# EAGLE design RPiZWAdapterBoard-Rev4 (EAGLE 9.5.1)
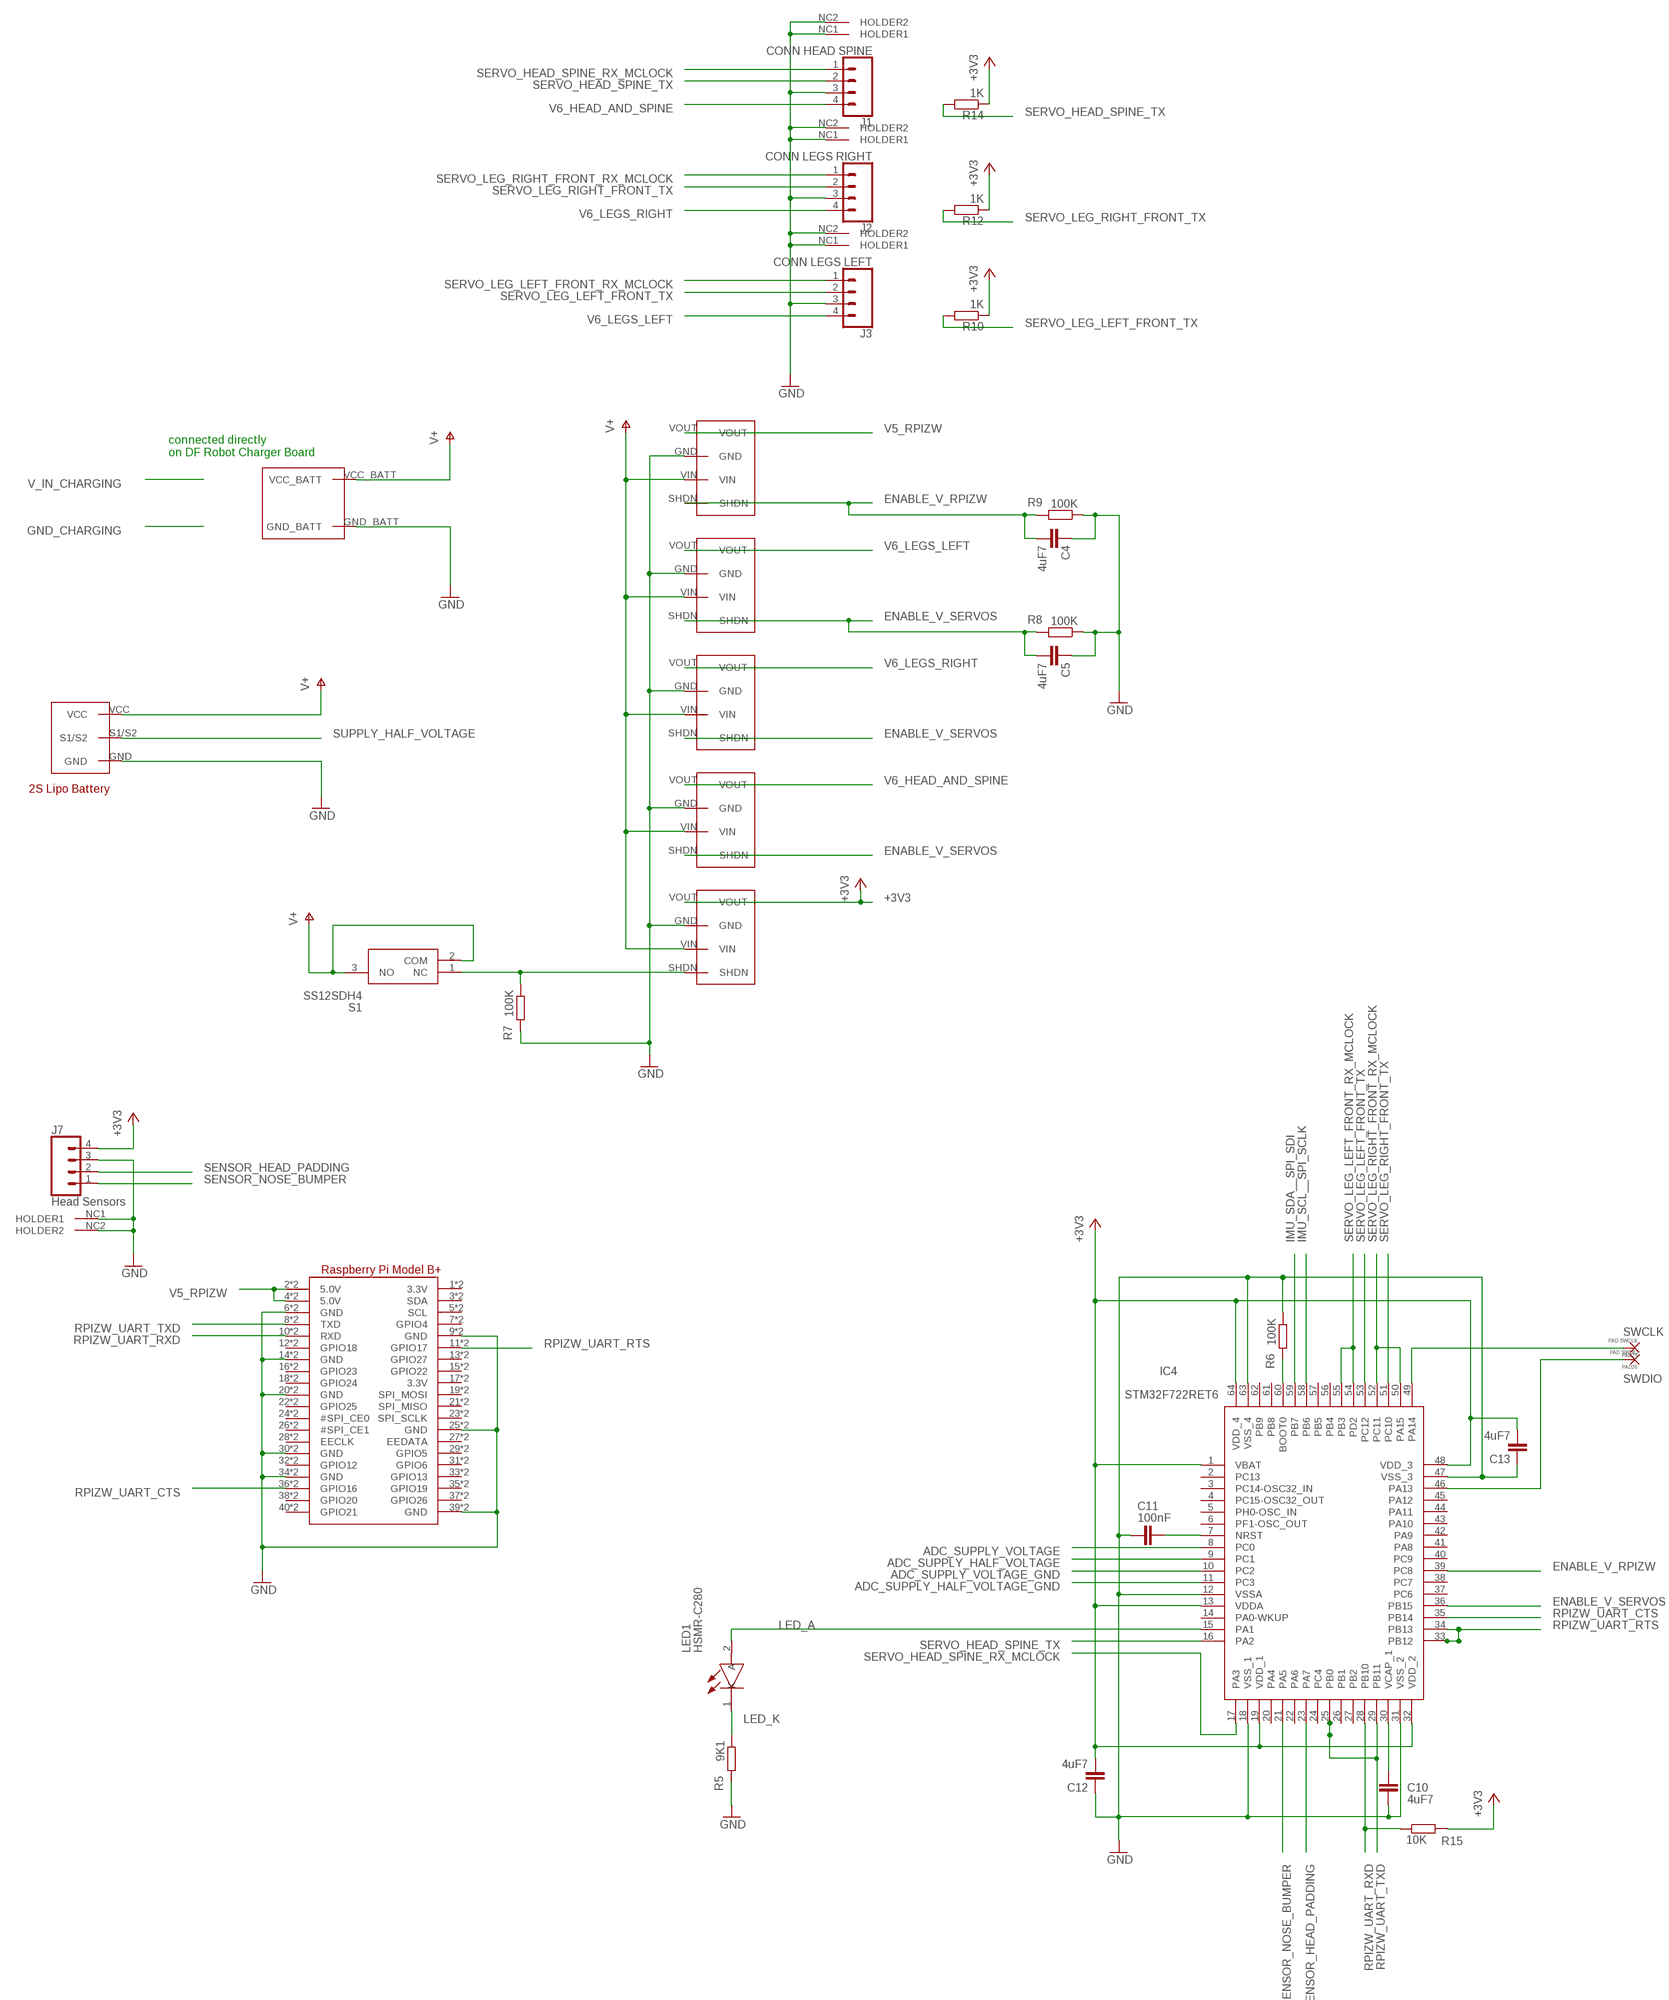
[diagram p0: schematic, sheet 1, part 1 of 2]
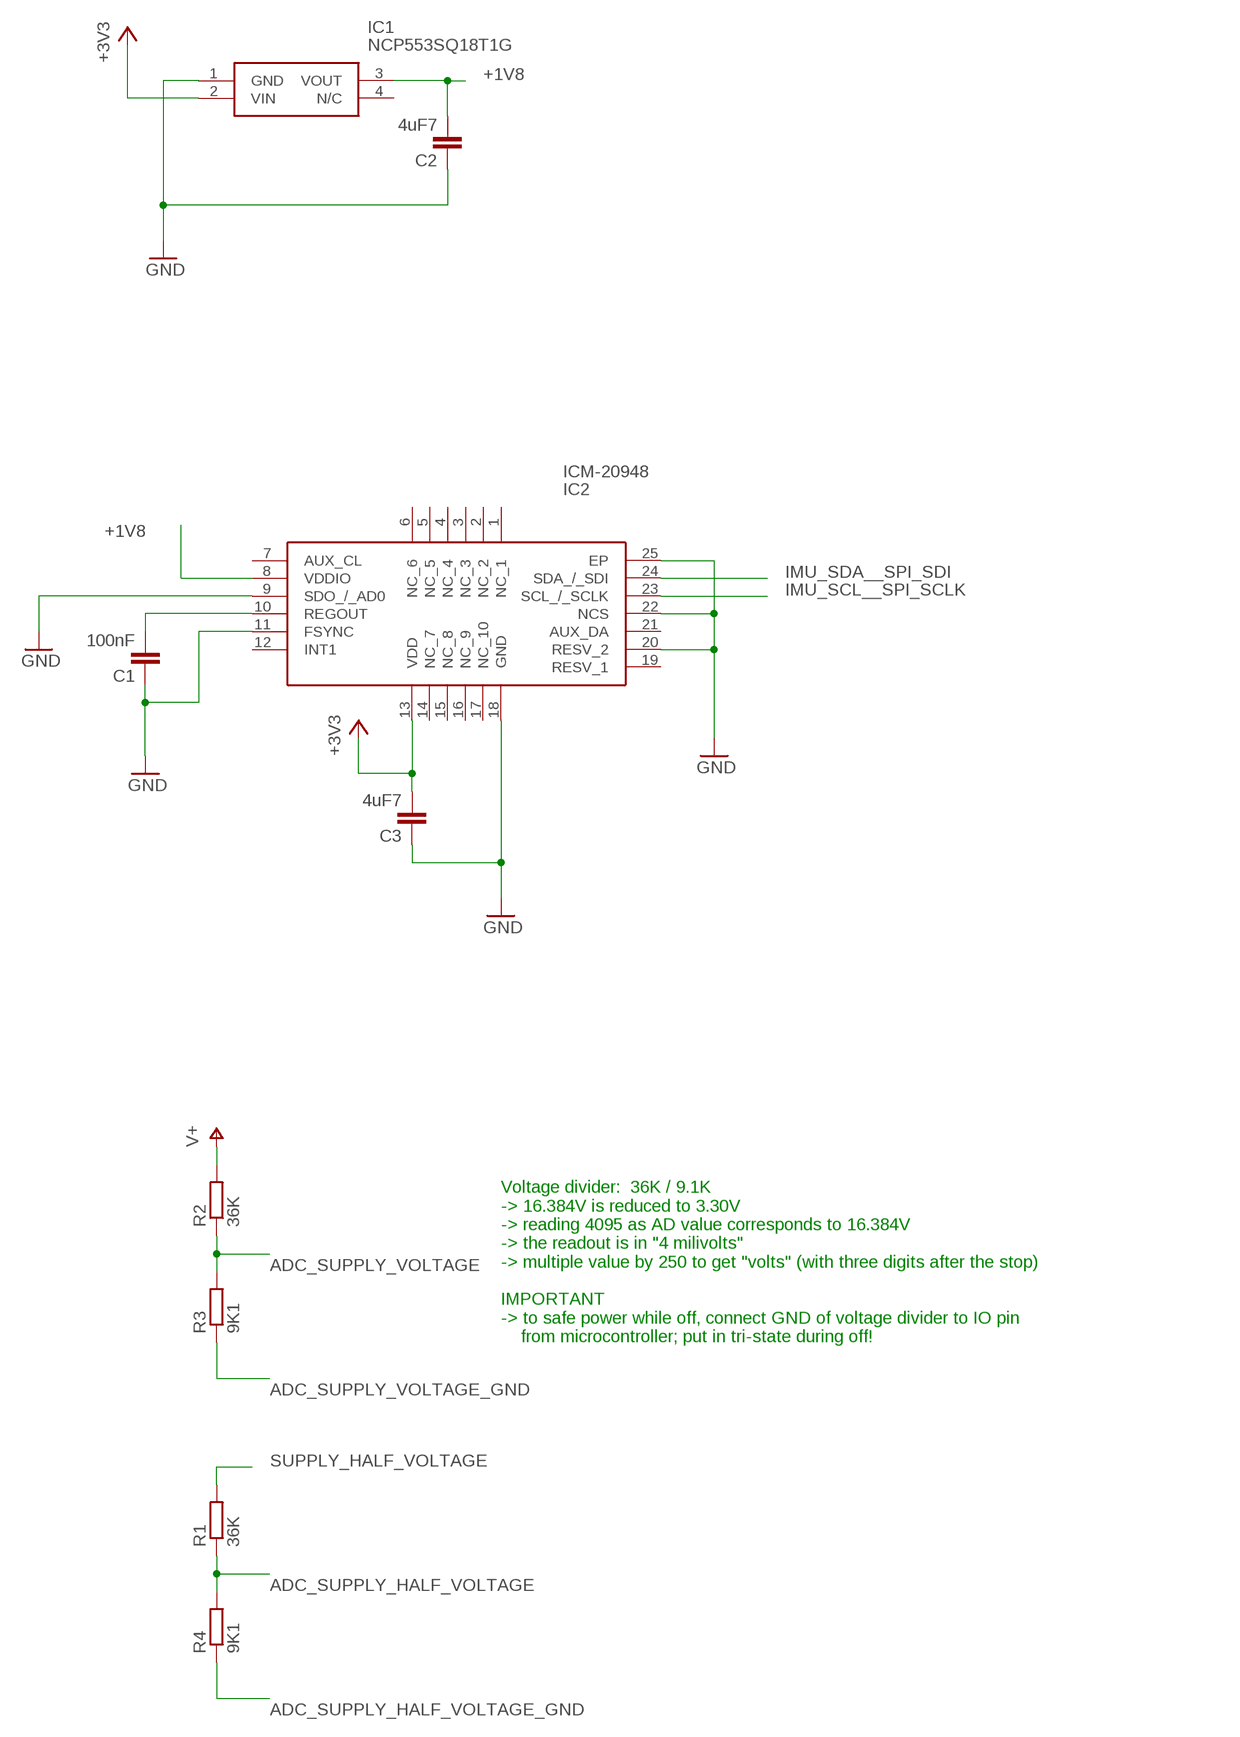
[diagram p1: schematic, sheet 1, part 2 of 2]

## Parts
C1  100nF  C-EUC0402  [C0402]
C2  4uF7  C-EUC0402  [C0402]
C3  4uF7  C-EUC0402  [C0402]
C4  4uF7  C-EUC0402  [C0402]
C5  4uF7  C-EUC0402  [C0402]
C10  4uF7  C-EUC0402  [C0402]
C11  100nF  C-EUC0402  [C0402]
C12  4uF7  C-EUC0402  [C0402]
C13  4uF7  C-EUC0402  [C0402]
IC1  NCP553SQ18T1G  [NCP563SQ18T1G]
IC2  ICM-20948  [QFN40P300X300X105-25N]
IC4  STM32F722RET6  [QFP50P1200X1200X160-64N]
J1  CONN HEAD SPINE  CONN_04SMD2  [JST04_SH_1MM]
J2  CONN LEGS RIGHT  CONN_04SMD2  [JST04_SH_1MM]
J3  CONN LEGS LEFT  CONN_04SMD2  [JST04_SH_1MM]
J7  Head Sensors  CONN_04SMD2  [JST04_SH_1MM]
LED1  HSMR-C280  [LEDC1005X50N]
PAD25  PAD SWCLK  SMD-PAD12X08  [SMD12X08]
PAD26  PAD SWDIO  SMD-PAD12X08  [SMD12X08]
R1  36K  R-EU_R0402  [R0402]
R2  36K  R-EU_R0402  [R0402]
R3  9K1  R-EU_R0402  [R0402]
R4  9K1  R-EU_R0402  [R0402]
R5  9K1  R-EU_R0402  [R0402]
R6  100K  R-EU_R0402  [R0402]
R7  100K  R-EU_R0402  [R0402]
R8  100K  R-EU_R0402  [R0402]
R9  100K  R-EU_R0402  [R0402]
R10  1K  R-EU_R0402  [R0402]
R12  1K  R-EU_R0402  [R0402]
R14  1K  R-EU_R0402  [R0402]
R15  10K  R-EU_R0402  [R0402]
RPI1  MICROBUILDER_RASPBERRYPI_BPLUSWIDE  [MICROBUILDER_PI_BONNET_THMSMT_WIDE]
S1  SS12SDH4  [SS12SDH4]
U$1  POLOLU_REGULATOR  [POLOLU_REGULATOR]
U$3  POLOLU_REGULATOR  [POLOLU_REGULATOR]
U$4  POLOLU_REGULATOR  [POLOLU_REGULATOR]
U$5  POLOLU_REGULATOR  [POLOLU_REGULATOR]
U$6  POLOLU_REGULATOR  [POLOLU_REGULATOR]
U$7  JST-S3B-XH-A_BATTCON  [JST-S3B-XH-A]
U$8  DFROBOT_CHARGER_CUTOUTNARROW  [DFROBOT_CHARGER_CUTOUT_NARROW]

## Nets
+1V8 [Power]: C2.2 IC1.3(VOUT) IC2.8(VDDIO)
+3V3 [Power]: C3.2 C12.2 C13.2 IC1.2(VIN) IC2.13(VDD) IC4.1(VBAT) IC4.13(VDDA) IC4.19(VDD_1) IC4.32(VDD_2) IC4.48(VDD_3) IC4.64(VDD_4) J7.4 R10.1 R12.1 R14.1 R15.2 U$6.VOUT
ADC_SUPPLY_HALF_VOLTAGE: IC4.9(PC1) R1.1 R4.2
ADC_SUPPLY_HALF_VOLTAGE_GND: IC4.11(PC3) R4.1
ADC_SUPPLY_VOLTAGE: IC4.8(PC0) R2.1 R3.2
ADC_SUPPLY_VOLTAGE_GND: IC4.10(PC2) R3.1
ENABLE_V_RPIZW: C4.2 IC4.39(PC8) R9.2 U$1.SHDN
ENABLE_V_SERVOS: C5.2 IC4.36(PB15) R8.2 U$3.SHDN U$4.SHDN U$5.SHDN
GND [Power]: C1.1 C2.1 C3.1 C4.1 C5.1 C10.1 C11.2 C12.1 C13.1 IC1.1(GND) IC2.9(SDO_/_AD0) IC2.11(FSYNC) IC2.18(GND) IC2.20(RESV_2) IC2.22(NCS) IC2.25(EP) IC4.12(VSSA) IC4.18(VSS_1) IC4.31(VSS_2) IC4.47(VSS_3) IC4.63(VSS_4) J1.3 J1.NC1(HOLDER1) J1.NC2(HOLDER2) J2.3 J2.NC1(HOLDER1) J2.NC2(HOLDER2) J3.3 J3.NC1(HOLDER1) J3.NC2(HOLDER2) J7.3 J7.NC1(HOLDER1) J7.NC2(HOLDER2) R5.2 R6.1 R7.2 R8.1 R9.1 RPI1.6(GND) RPI1.9(GND) RPI1.14(GND) RPI1.20(GND) RPI1.25(GND) RPI1.30(GND) RPI1.34(GND) RPI1.39(GND) RPI1.S6(GND) RPI1.S9(GND) RPI1.S14(GND) RPI1.S20(GND) RPI1.S25(GND) RPI1.S30(GND) RPI1.S34(GND) RPI1.S39(GND) U$1.GND U$3.GND U$4.GND U$5.GND U$6.GND U$7.GND U$8.GND_BATT
IMU_SCL__SPI_SCLK: IC2.23(SCL_/_SCLK) IC4.58(PB6)
IMU_SDA__SPI_SDI: IC2.24(SDA_/_SDI) IC4.59(PB7)
LED_A: IC4.15(PA1) LED1.2(A)
LED_K: LED1.1(K) R5.1
N$1: R7.1 S1.1(NC) U$6.SHDN
N$2: C1.2 IC2.10(REGOUT)
N$6: IC4.60(BOOT0) R6.2
N$7: C11.1 IC4.7(NRST)
N$8: C10.2 IC4.30(VCAP_1)
RPIZW_UART_CTS: IC4.35(PB14) RPI1.36(GPIO16) RPI1.S36(GPIO16)
RPIZW_UART_RTS: IC4.33(PB12) IC4.34(PB13) RPI1.11(GPIO17) RPI1.S11(GPIO17)
RPIZW_UART_RXD: IC4.28(PB10) R15.1 RPI1.10(RXD) RPI1.S10(RXD)
RPIZW_UART_TXD: IC4.25(PB0) IC4.29(PB11) RPI1.8(TXD) RPI1.S8(TXD)
SENSOR_HEAD_PADDING: IC4.23(PA7) J7.2
SENSOR_NOSE_BUMPER: IC4.21(PA5) J7.1
SERVO_HEAD_SPINE_RX_MCLOCK: IC4.17(PA3) J1.1
SERVO_HEAD_SPINE_TX: IC4.16(PA2) J1.2 R14.2
SERVO_LEG_LEFT_FRONT_RX_MCLOCK: IC4.54(PD2) IC4.55(PB3) J3.1
SERVO_LEG_LEFT_FRONT_TX: IC4.53(PC12) J3.2 R10.2
SERVO_LEG_RIGHT_FRONT_RX_MCLOCK: IC4.50(PA15) IC4.52(PC11) J2.1
SERVO_LEG_RIGHT_FRONT_TX: IC4.51(PC10) J2.2 R12.2
SUPPLY_HALF_VOLTAGE: R1.2 U$7.S1/S2
SWCLK: IC4.49(PA14) PAD25.1(P)
SWDIO: IC4.46(PA13) PAD26.1(P)
V5_RPIZW [Power]: RPI1.2(5.0V) RPI1.4(5.0V) RPI1.S2(5.0V) RPI1.S4(5.0V) U$1.VOUT
V6_HEAD_AND_SPINE [Power]: J1.4 U$5.VOUT
V6_LEGS_LEFT [Power]: J3.4 U$3.VOUT
V6_LEGS_RIGHT [Power]: J2.4 U$4.VOUT
V+ [Power]: R2.2 S1.2(COM) S1.3(NO) U$1.VIN U$3.VIN U$4.VIN U$5.VIN U$6.VIN U$7.VCC U$8.VCC_BATT
Unconnected: IC1.4(N/C) IC2.1(NC_1) IC2.2(NC_2) IC2.3(NC_3) IC2.4(NC_4) IC2.5(NC_5) IC2.6(NC_6) IC2.7(AUX_CL) IC2.12(INT1) IC2.14(NC_7) IC2.15(NC_8) IC2.16(NC_9) IC2.17(NC_10) IC2.19(RESV_1) IC2.21(AUX_DA) IC4.2(PC13) IC4.3(PC14-OSC32_IN) IC4.4(PC15-OSC32_OUT) IC4.5(PH0-OSC_IN) IC4.6(PF1-OSC_OUT) IC4.14(PA0-WKUP) IC4.20(PA4) IC4.22(PA6) IC4.24(PC4) IC4.26(PB1) IC4.27(PB2) IC4.37(PC6) IC4.38(PC7) IC4.40(PC9) IC4.41(PA8) IC4.42(PA9) IC4.43(PA10) IC4.44(PA11) IC4.45(PA12) IC4.56(PB4) IC4.57(PB5) IC4.61(PB8) IC4.62(PB9) RPI1.1(3.3V) RPI1.3(SDA) RPI1.5(SCL) RPI1.7(GPIO4) RPI1.12(GPIO18) RPI1.13(GPIO27) RPI1.15(GPIO22) RPI1.16(GPIO23) RPI1.17(3.3V) RPI1.18(GPIO24) RPI1.19(SPI_MOSI) RPI1.21(SPI_MISO) RPI1.22(GPIO25) RPI1.23(SPI_SCLK) RPI1.24(#SPI_CE0) RPI1.26(#SPI_CE1) RPI1.27(EEDATA) RPI1.28(EECLK) RPI1.29(GPIO5) RPI1.31(GPIO6) RPI1.32(GPIO12) RPI1.33(GPIO13) RPI1.35(GPIO19) RPI1.37(GPIO26) RPI1.38(GPIO20) RPI1.40(GPIO21) RPI1.S1(3.3V) RPI1.S3(SDA) RPI1.S5(SCL) RPI1.S7(GPIO4) RPI1.S12(GPIO18) RPI1.S13(GPIO27) RPI1.S15(GPIO22) RPI1.S16(GPIO23) RPI1.S17(3.3V) RPI1.S18(GPIO24) RPI1.S19(SPI_MOSI) RPI1.S21(SPI_MISO) RPI1.S22(GPIO25) RPI1.S23(SPI_SCLK) RPI1.S24(#SPI_CE0) RPI1.S26(#SPI_CE1) RPI1.S27(EEDATA) RPI1.S28(EECLK) RPI1.S29(GPIO5) RPI1.S31(GPIO6) RPI1.S32(GPIO12) RPI1.S33(GPIO13) RPI1.S35(GPIO19) RPI1.S37(GPIO26) RPI1.S38(GPIO20) RPI1.S40(GPIO21)

## Notes on the sheet
- connected directly
  on DF Robot Charger Board
- Voltage divider:  36K / 9.1K 
  -> 16.384V is reduced to 3.30V
  -> reading 4095 as AD value corresponds to 16.384V
  -> the readout is in "4 milivolts"
  -> multiple value by 250 to get "volts" (with three digits after the stop)
  
  IMPORTANT
  -> to safe power while off, connect GND of voltage divider to IO pin
      from microcontroller; put in tri-state during off!

## Library data of the parts
C1-C5 C10-C13 = rcl:C-EU: CAPACITOR, European symbol; SPICEPREFIX: C
IC1 = HBPMouse:NCP553SQ18T1G: LDO Voltage Regulators LDO LINEAR REGULATOR Source: Datasheet <https://componentsearchengine.com/Datasheets/1/NCV553SQ30T1G.pdf>; DESCRIPTION: LDO Voltage Regulators LDO LINEAR REGULATOR; HEIGHT: mm; MANUFACTURER_NAME: ON Semiconductor; MANUFACTURER_PART_NUMBER: NCV553SQ30T1G; MOUSER_PART_NUMBER: 863-NCV553SQ30T1G; MOUSER_PRICE-STOCK: https://www.mouser.com/Search/Refine.aspx?Keyword=863-NCV553SQ30T1G
IC2 = HBPMouse:ICM-20948: IMUs - Inertial Measurement Units World's Lowest Power 9-Axis MEMS MotionTracking Device Source: Datasheet <https://www.mouser.co.uk/datasheet/2/400/DS-000189-ICM-20948-v1.3-1385562.pdf>; DESCRIPTION: IMUs - Inertial Measurement Units World's Lowest Power 9-Axis MEMS MotionTracking Device; HEIGHT: 1.05mm; MANUFACTURER_NAME: TDK; MANUFACTURER_PART_NUMBER: ICM-20948; MOUSER_PART_NUMBER: 410-ICM-20948
IC4 = HBPMouse:STM32F722RET6: ARM Microcontrollers - MCU High-performance and DSP with FPU, ARM(r) Cortex(r)-M7 MCU with 512 Kbytes Flash, 216 MHz CPU, Art Accelerator, L1 cache, SDRAM Source: Datasheet <https://componentsearchengine.com/Datasheets/1/STM32F722RET6.pdf>; DESCRIPTION: ARM Microcontrollers - MCU High-performance and DSP with FPU, ARM(r) Cortex(r)-M7 MCU with 512 Kbytes Flash, 216 MHz CPU, Art Accelerator, L1 cache, SDRAM; HEIGHT: 1.6mm; MANUFACTURER_NAME: STMicroelectronics; MANUFACTURER_PART_NUMBER: STM32F722RET6; MOUSER_PART_NUMBER: 511-STM32F722RET6; MOUSER_PRICE-STOCK: https://www.mouser.com/Search/Refine.aspx?Keyword=511-STM32F722RET6
J1-J3 J7 = HBPMouse:CONN_04: Multi connection point. Often used as Generic Header-pin footprint for 0.1 inch spaced/style header connections On any of the 0.1 inch spaced packages, you can populate with these: Break Away Headers - Straight <https://www.sparkfun.com/products/116> (PRT-00116) Break Away Male Headers - Right Angle <https://www.sparkfun.com/products/553> (PRT-00553) Female Headers <https://www.sparkfun.com/products/115> (PRT-00115) Break Away Headers - Machine Pin <https://www.sparkfun.com/products/117> (PRT-00117) Break Away Female Headers - Swiss Machine Pin <https://www.sparkfun.com/products/743> (PRT-00743) For SCREWTERMINALS and SPRING TERMINALS visit here: Screw Terimnals on SparkFun.com <https://www.sparkfun.com/search/results?term=Screw+Terminals> (5mm/3.5mm/2.54mm spacing) This device is also useful as a general connection point to wire up your design to another part of your project. Our various solder wires solder well into these plated through hole pads. Hook-Up Wire - Assortment (Stranded, 22 AWG) <https://www.sparkfun.com/products/11375> (PRT-11375) Hook-Up Wire - Assortment (Solid Core, 22 AWG) <https://www.sparkfun.com/products/11367> (PRT-11367) View the entire wire category on our website here <https://www.sparkfun.com/categories/141> Special notes: Molex polarized connector foot print use with SKU : PRT-08231 with associated crimp pins and housings. 1MM SMD Version SKU: PRT-10208; PROD_ID: CONN-10310; SF_ID: PRT-10208
LED1 = HBPMouse:HSMR-C280: BROADCOM LIMITED - HSMR-C280 - LED, BLUE, 80MCD, 465NM, 0402 Source: Datasheet <https://media.digikey.com/pdf/Data Sheets/Avago PDFs/HSMR-C280.pdf>; DESCRIPTION: BROADCOM LIMITED - HSMR-C280 - LED, BLUE, 80MCD, 465NM, 0402; HEIGHT: 0.5mm; MANUFACTURER_NAME: Avago Technologies; MANUFACTURER_PART_NUMBER: HSMR-C280; MOUSER_PART_NUMBER: 630-HSMR-C280; MOUSER_PRICE-STOCK: https://www.mouser.com/Search/Refine.aspx?Keyword=630-HSMR-C280
PAD25 PAD26 = HBPMouse:SMD-PAD: SMD PAD
R1-R10 R12 R14 R15 = rcl:R-EU_: RESISTOR, European symbol; SPICEPREFIX: R
RPI1 = HBPMouse:MICROBUILDER_RASPBERRYPI_BPLUS
S1 = HBPMouse:SS12SDH4: PCB Slide Switch SPDT On-None-On 100 mA Side Source: Datasheet <https://componentsearchengine.com/Datasheets/1/SS12SDH4.pdf>; DESCRIPTION: PCB Slide Switch SPDT On-None-On 100 mA Side; HEIGHT: 4.5mm; MANUFACTURER_NAME: NKK Switches; MANUFACTURER_PART_NUMBER: SS12SDH4; MOUSER_PART_NUMBER: 633-SS12SDH4; MOUSER_PRICE-STOCK: https://www.mouser.com/Search/Refine.aspx?Keyword=633-SS12SDH4
U$1 U$3-U$6 = HBPMouse:POLOLU_REGULATOR
U$7 = HBPMouse:JST-S3B-XH-A_BATTCON: JST-XH Connector for 2S LIPO Battery
U$8 = HBPMouse:DFROBOT_CHARGER_CUTOUT

## Net classes
1 Power: width 0.3 mm

## Board
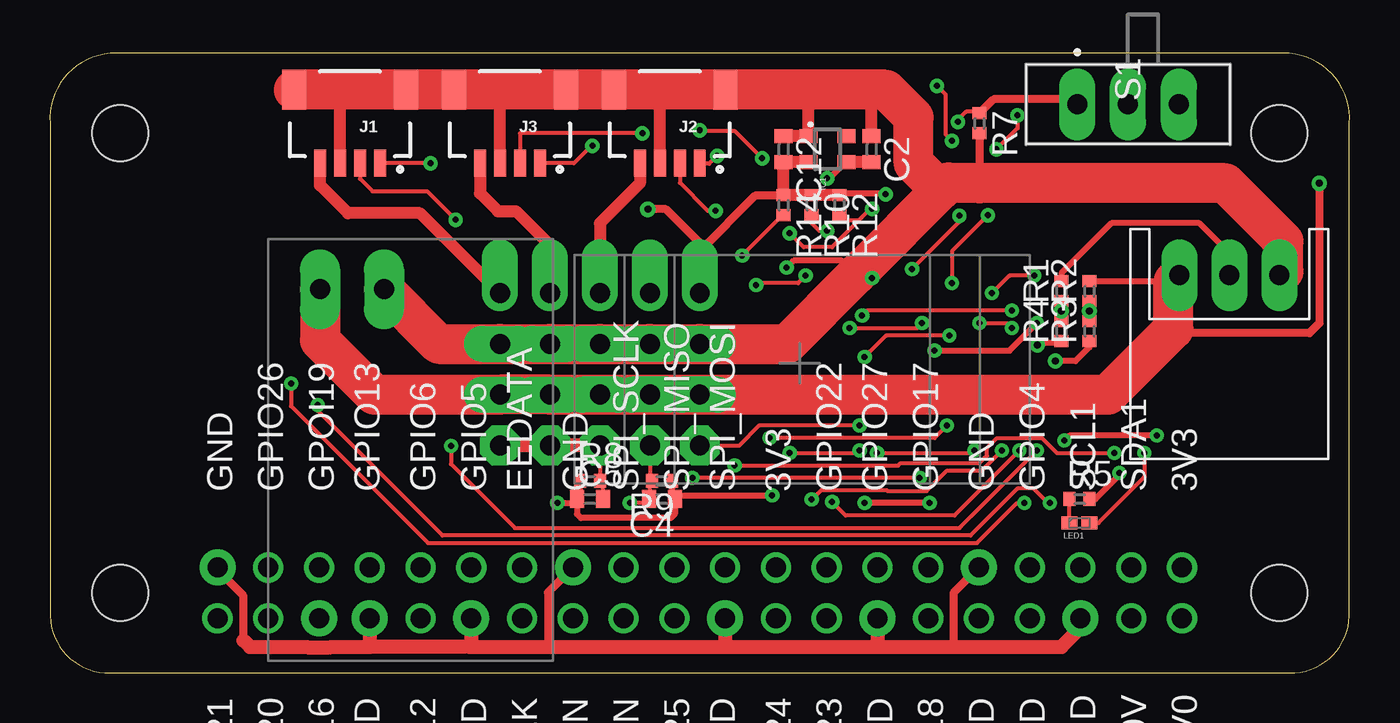
[diagram p2: board, top side]
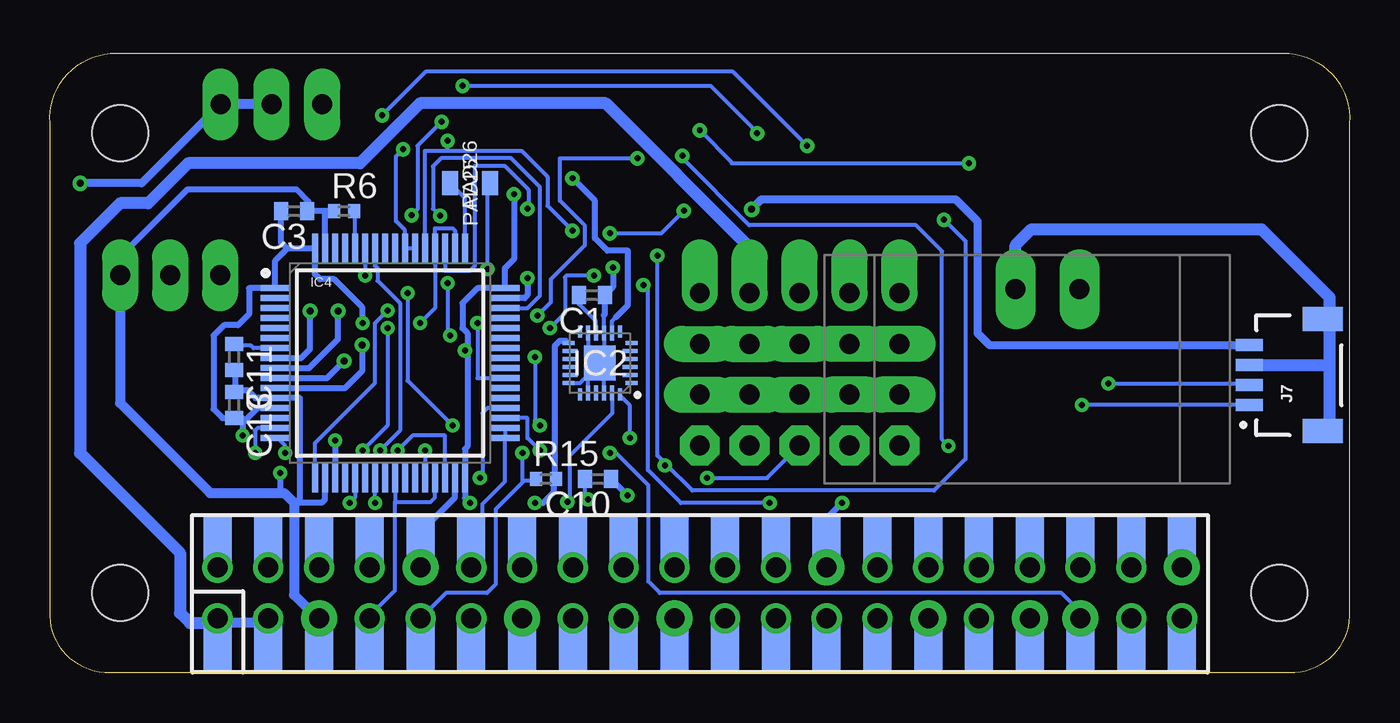
[diagram p3: board, bottom side, seen from below]

Size 65.02 x 31 mm. Coordinates in mm from the lower left corner, seen from the top.
Copper layers (1*16): Top 0.035mm / dielectric 0.8mm / Bottom 0.035mm
Design rules "default *": minimum track width 0.2mm, minimum drill 0.3mm, track to track 0.15mm, track to pad 0.17mm, pad to pad 0.17mm, via to via 0.15mm, smd to smd 0mil, copper to edge 0.2mm, drill to drill 0.3mm, minimum pad ring 10mil, minimum via ring 8mil, stop-mask expansion 2mil, vias tented up to drill 0mil, thermal gap 10mil
tRestrict: area 27.5,-2.5 to 31.2,0.7; area 63.9,20.4 to 67.6,23.6; area 25.7,30.3 to 29.4,33.5; area 50.9,30.4 to 54.6,33.6; area 53.2,30.4 to 56.9,33.6; area 23.6,18.3 to 23.8,21.5; area 26.1,18.3 to 26.3,21.5; area 28.6,18.3 to 28.8,21.5; area 31.1,18.3 to 31.3,21.5; area 20.6,17.6 to 34.2,17.9; area 20.6,15 to 34.2,15.3; area 20.6,12.5 to 34.2,12.8
bRestrict: area 63.9,20.1 to 67.6,23.3; area 26,30.3 to 29.7,33.5; area 50.7,30.4 to 54.4,33.6; area 23.7,18.3 to 23.9,21.5; area 26.2,18.3 to 26.4,21.5; area 28.7,18.3 to 28.9,21.5; area 31.2,18.3 to 31.4,21.5; area 20.6,14.9 to 34.2,15.5; area 20.6,17.4 to 34.2,18; area 20.6,12.4 to 34.2,13
vRestrict: area 7.2,3.8 to 57.7,4.2; area 12,2.3 to 12.2,5.5; area 9.5,2.3 to 9.7,5.5; area 14.6,2.3 to 14.8,5.5; area 17.1,2.3 to 17.3,5.5; area 19.6,2.3 to 19.8,5.5; area 22.2,2.3 to 22.4,5.5; area 24.7,2.3 to 24.9,5.5; area 27.3,2.3 to 27.5,5.5; area 29.8,2.3 to 30,5.5; area 32.4,2.3 to 32.6,5.5; area 35,2.3 to 35.2,5.5; area 37.4,2.3 to 37.6,5.5; area 40,2.3 to 40.2,5.5; area 42.6,2.3 to 42.8,5.5; area 45.1,2.3 to 45.3,5.5; area 47.7,2.3 to 47.9,5.5; area 50.2,2.3 to 50.4,5.5; area 52.7,2.3 to 52.9,5.5; area 55.2,2.4 to 55.4,5.6; area 57.8,2.4 to 58,5.6; area 9.5,5.1 to 9.7,8.3; area 12,5.1 to 12.2,8.3; area 14.6,5.1 to 14.8,8.3; area 17.1,5.1 to 17.3,8.3; area 19.6,5.1 to 19.8,8.3; area 22.2,5.1 to 22.4,8.3; area 24.7,5.1 to 24.9,8.3; area 27.3,5.1 to 27.5,8.3; area 29.8,5.1 to 30,8.3; area 32.4,5.1 to 32.6,8.3; area 35,5.1 to 35.2,8.3; area 37.4,5.1 to 37.6,8.3; area 40,5.1 to 40.2,8.3; area 42.6,5.1 to 42.8,8.3; area 45.1,5.1 to 45.3,8.3; area 47.7,5.1 to 47.9,8.3; area 50.2,5.1 to 50.4,8.3; area 52.7,5.1 to 52.9,8.3; area 55.2,5.1 to 55.4,8.3; area 57.8,5.1 to 58,8.3

### Footprints (pad centres in the part's own frame; a part is rotated, then mirrored left to right if it is on the bottom)
C0402 = smd 0.7 x 0.9: 1 -0.65,0; 2 0.65,0
NCP563SQ18T1G = smd 0.7 x 0.9: 1 -0.65,-0.95; 2 0.65,-0.95; 3 0.65,0.95; 4 -0.65,0.95
QFN40P300X300X105-25N = smd 0.6 x 0.2: 1 -1.575,1; 6 -1.575,-1; 13 1.575,-1; 18 1.575,1 | smd 0.75 x 0.2: 2 -1.5,0.6; 3 -1.5,0.2; 4 -1.5,-0.2; 5 -1.5,-0.6; 14 1.5,-0.6; 15 1.5,-0.2; 16 1.5,0.2; 17 1.5,0.6 | smd 0.2 x 0.6: 7 -1,-1.575; 12 1,-1.575; 19 1,1.575; 24 -1,1.575 | smd 0.2 x 0.75: 8 -0.6,-1.5; 9 -0.2,-1.5; 10 0.2,-1.5; 11 0.6,-1.5; 20 0.6,1.5; 21 0.2,1.5; 22 -0.2,1.5; 23 -0.6,1.5 | smd 1.59 x 1.75: 25 0,0
QFP50P1200X1200X160-64N = smd 1.475 x 0.3: 1 -5.738,3.75; 2 -5.738,3.25; 3 -5.738,2.75; 4 -5.738,2.25; 5 -5.738,1.75; 6 -5.738,1.25; 7 -5.738,0.75; 8 -5.738,0.25; 9 -5.738,-0.25; 10 -5.738,-0.75; 11 -5.738,-1.25; 12 -5.738,-1.75; 13 -5.738,-2.25; 14 -5.738,-2.75; 15 -5.738,-3.25; 16 -5.738,-3.75; 33 5.738,-3.75; 34 5.738,-3.25; 35 5.738,-2.75; 36 5.738,-2.25; 37 5.738,-1.75; 38 5.738,-1.25; 39 5.738,-0.75; 40 5.738,-0.25; 41 5.738,0.25; 42 5.738,0.75; 43 5.738,1.25; 44 5.738,1.75; 45 5.738,2.25; 46 5.738,2.75; 47 5.738,3.25; 48 5.738,3.75 | smd 0.3 x 1.475: 17 -3.75,-5.738; 18 -3.25,-5.738; 19 -2.75,-5.738; 20 -2.25,-5.738; 21 -1.75,-5.738; 22 -1.25,-5.738; 23 -0.75,-5.738; 24 -0.25,-5.738; 25 0.25,-5.738; 26 0.75,-5.738; 27 1.25,-5.738; 28 1.75,-5.738; 29 2.25,-5.738; 30 2.75,-5.738; 31 3.25,-5.738; 32 3.75,-5.738; 49 3.75,5.738; 50 3.25,5.738; 51 2.75,5.738; 52 2.25,5.738; 53 1.75,5.738; 54 1.25,5.738; 55 0.75,5.738; 56 0.25,5.738; 57 -0.25,5.738; 58 -0.75,5.738; 59 -1.25,5.738; 60 -1.75,5.738; 61 -2.25,5.738; 62 -2.75,5.738; 63 -3.25,5.738; 64 -3.75,5.738
JST04_SH_1MM = smd 0.6 x 1.35: 1 -1.5,0; 2 -0.5,0; 3 0.5,0; 4 1.5,0 | smd 1.2 x 2: NC1 2.8,-3.675; NC2 -2.8,-3.675
LEDC1005X50N = smd 0.8 x 0.65: 1 -0.5,0; 2 0.5,0
SMD12X08 = smd 0.8 x 1.2: 1 0,0
R0402 = smd 0.6 x 0.7: 1 -0.5,0; 2 0.5,0
MICROBUILDER_PI_BONNET_THMSMT_WIDE = drill 1 pad 1.4: 1 8.37,25.23; 2 8.37,27.77; 3 10.91,25.23; 4 10.91,27.77; 5 13.45,25.23; 7 15.99,25.23; 8 15.99,27.77; 10 18.53,27.77; 11 21.07,25.23; 12 21.07,27.77; 13 23.61,25.23; 15 26.15,25.23; 16 26.15,27.77; 17 28.69,25.23; 18 28.69,27.77; 19 31.23,25.23; 21 33.77,25.23; 22 33.77,27.77; 23 36.31,25.23; 24 36.31,27.77; 26 38.85,27.77; 27 41.39,25.23; 28 41.39,27.77; 29 43.93,25.23; 31 46.47,25.23; 32 46.47,27.77; 33 49.01,25.23; 35 51.55,25.23; 37 54.09,25.23; 38 54.09,27.77; 40 56.63,27.77 | drill 1 pad 1.8: 6 13.45,27.77; 9 18.53,25.23; 14 23.61,27.77; 20 31.23,27.77; 25 38.85,25.23; 30 43.93,27.77; 34 49.01,27.77; 36 51.55,27.77; 39 56.63,25.23 | smd 1.4 x 3 bottom: S1 8.37,24.039; S2 8.37,28.957; S3 10.91,24.039; S4 10.91,28.957; S5 13.45,24.039; S6 13.45,28.957; S7 15.99,24.039; S8 15.99,28.957; S9 18.53,24.039; S10 18.53,28.957; S11 21.07,24.039; S12 21.07,28.957; S13 23.61,24.039; S14 23.61,28.957; S15 26.15,24.039; S16 26.15,28.957; S17 28.69,24.039; S18 28.69,28.957; S19 31.23,24.039; S20 31.23,28.957; S21 33.77,24.039; S22 33.77,28.957; S23 36.31,24.039; S24 36.31,28.957; S25 38.85,24.039; S26 38.85,28.957; S27 41.39,24.039; S28 41.39,28.957; S29 43.93,24.039; S30 43.93,28.957; S31 46.47,24.039; S32 46.47,28.957; S33 49.01,24.039; S34 49.01,28.957; S35 51.55,24.039; S36 51.55,28.957; S37 54.09,24.039; S38 54.09,28.957; S39 56.63,24.039; S40 56.63,28.957 | hole 2.8: 3.5,26.5; 61.5,26.5; 61.5,3.5; 3.5,3.5
SS12SDH4 = drill 1 pad 1.8 long: 1 0,0; 2 0,-2.54; 3 0,-5.08
POLOLU_REGULATOR = drill 1 pad 1.8 long: GND 0,-2.54; VIN 0,-5.08 | drill 1 pad 2 octagon: SHDN 0,-7.62 | drill 1 pad 1.8 offset: VOUT 0,0
JST-S3B-XH-A = drill 1 pad 1.8 long: GND -2.5,0; S1/S2 0,0; VCC 2.5,0
DFROBOT_CHARGER_CUTOUT_NARROW = drill 1 pad 2 long: GND_BATT 0,-5.2; VCC_BATT 0,-8.4

### Placement (x,y rotation side)
C1  37.91,18.9 180 bottom
C2  41.11,26.2 270 top
C3  52.81,23.1 180 bottom
C4  30.61,8.7 180 top
C5  27.01,8.7 0 top
C10  37.61,9.7 180 bottom
C11  55.81,15.8 270 bottom
C12  36.71,26.2 270 top
C13  55.81,13.4 270 bottom
IC1  38.91,26.2 270 top
IC2  37.51,15.5 180 bottom
IC4  48.01,15.5 0 bottom
J1  15.01,25.5 180 top
J2  31.01,25.5 180 top
J3  23.01,25.5 180 top
J7  5.01,14.9 90 bottom
LED1  51.51,7.5 0 top
PAD25  45.01,24.5 180 bottom
PAD26  43.01,24.5 0 bottom
R1  50.61,19.1 90 top
R2  52.01,19.1 90 top
R3  52.01,17.1 90 top
R4  50.61,17.1 90 top
R5  51.51,8.7 0 top
R6  50.31,23.1 0 bottom
R7  46.51,27.5 270 top
R8  27.01,9.6 0 top
R9  30.61,9.6 180 top
R10  38.11,23.4 270 top
R12  39.51,23.4 270 top
R14  36.71,23.4 270 top
R15  40.21,9.7 0 bottom
RPI1  65.01,30.5 180 top
S1  51.4,28.46 90 top
U$1  30.01,19 0 top
U$3  25.01,19 0 bottom
U$4  27.51,19 0 top
U$5  22.51,19 0 bottom
U$6  32.51,19 0 top
U$7  59.01,19.9 180 top
U$8  21.91,19.2 270 top

### Tracks (layer width: path | path; a pad name or v marks a point on that pad's centre or on a via)
+1V8  (via drill 0.3)
  Top 0.3: v38.88,24.75 39.01,24.75 39.63,25.38 IC1.3
  Top 0.6: C2.2 IC1.3
  Bottom 0.2: IC2.8 36.91,17.6 36.71,17.8
  Bottom 0.3: 36.71,17.8 36.11,18.4 36.11,21.12 37.13,21.12 37.76,21.75 37.76,23.62 v38.88,24.75
+3V3  (via drill 0.3, 0.35)
  Top 0.3: v50.76,11.62 51.01,11.88 v55.38,11.88 | v44.01,8.5 v40.76,8.5 | v41.81,23.95 41.78,23.98 39.58,23.98 R12.1 | v49.38,17.5 48.01,16.12 v44.26,16.12
  Top 0.4: U$6.VOUT 32.51,21.1 | 32.51,21.1 32.51,21.5 30.81,23.2 v29.91,23.2 | 32.51,21.1 35.31,23.9 R14.1
  Top 0.6: IC1.2 C12.2 R14.1 R10.1 R12.1
  Bottom 0.2: IC2.13 39.21,16.62
  Bottom 0.3: C13.2 55.38,12.75 55.38,12.5 54.63,13.25 IC4.13 | v50.76,11.62 IC4.19 | v55.38,11.88 55.38,12.62 C13.2 | C13.2 56.38,12.75 56.83,13.2 56.83,16.88 56.31,17.4 55.61,17.4 55.06,17.95 55.06,19.25 IC4.1 53.75,20.64 53.15,21.24 | 39.21,16.62 39.51,16.62 39.76,16.38 39.76,9.75 R15.2 39.76,9.62 39.81,9.57 39.81,9.05 40.36,8.5 v40.76,8.5 | 44.13,16.12 44.13,17 44.38,17.25 44.38,18.5 43.63,19.25 IC4.48 42.27,20.24 41.81,20.7 v41.81,23.95 | 44.13,16.12 44.13,11.32 44.26,11.2 IC4.32 44.26,8.75 v44.01,8.5 | v44.26,16.12 44.13,16.12 | v49.38,17.5 49.38,18.27 50.81,19.7 51.51,19.7 51.76,19.95 IC4.64 53.15,21.24 | C3.2 53.46,21.55 53.15,21.24
  Bottom 0.4: v29.91,23.2 29.41,23.7 19.71,23.7 18.61,22.6 18.61,17 18.01,16.4 J7.4
ADC_SUPPLY_HALF_VOLTAGE  (via drill 0.35)
  Top 0.3: R1.1 v50.61,18.1 R4.2
  Bottom 0.3: IC4.9 52.06,15.25 50.61,16.7 v50.61,18.1
ADC_SUPPLY_HALF_VOLTAGE_GND  (via drill 0.35)
  Top 0.3: R4.1 50.51,16.5 49.51,16.5 v49.41,16.4
  Bottom 0.3: IC4.11 50.26,14.25 49.41,15.1 v49.41,16.4
ADC_SUPPLY_VOLTAGE  (via drill 0.35)
  Top 0.3: R2.1 v52.01,18.1 R3.2
  Bottom 0.3: IC4.8 52.46,15.75 52.01,16.2 v52.01,18.1
ADC_SUPPLY_VOLTAGE_GND  (via drill 0.35)
  Top 0.3: R3.1 52.01,16.3 51.31,15.6 v50.31,15.6
  Bottom 0.3: IC4.10 51.16,14.75 v50.31,15.6
ENABLE_V_RPIZW  (via drill 0.3)
  Top 0.2: v43.63,17.5 43.38,17.25 v40.01,17.25 | v37.81,19.88 37.43,19.5 35.43,19.5 v35.33,19.4 | v29.01,8.5 29.81,8.5 C4.2 30.01,8.88 30.01,9.5 R9.2 30.01,9.62 U$1.SHDN
  Bottom 0.2: IC4.39 43.63,14.75 v43.63,17.5 | v40.01,17.25 39.26,18 39.26,19.8 39.18,19.88 v37.81,19.88 | v35.33,19.4 35.11,19.18 35.11,10.15 33.46,8.5 v29.01,8.5
ENABLE_V_SERVOS  (via drill 0.3)
  Top 0.2: v43.51,9.75 v32.13,9.75 | U$4.SHDN R8.2 27.51,9.5 27.63,9.38 27.63,8.75 C5.2
  Top 0.7: U$4.SHDN U$3.SHDN U$5.SHDN
  Bottom 0.2: v32.13,9.75 29.13,9.75 U$4.SHDN | v43.51,9.75 43.38,9.88 43.38,13 43.13,13.25 IC4.36
GND  (via drill 0.3)
  Top 0.3: 21.08,1.37 21.01,1.3 | 33.78,1.33 33.81,1.3 | 41.4,1.31 41.41,1.3 | C4.1 31.26,8.5 31.13,8.5 31.13,8.88 v36.13,8.88 | v41.13,19.75 40.65,20.24 | v36.86,20.27 37.21,20.62 39.63,20.62 40.33,19.93 | v25.38,8.5 26.16,8.5 C5.1 | R8.1 26.51,8.75 C5.1 | R9.1 31.13,9.5 31.13,9 C4.1 | C5.1 26.36,7.95 26.56,7.75 31.06,7.75 31.26,7.95 C4.1 | R5.2 52.31,8.7 53.51,9.9 v53.51,10
  Top 0.4: RPI1.25 24.91,4.02 24.91,1.3 | RPI1.9 45.21,4 45.21,1.3 | 9.68,1.63 9.68,3.84 8.38,5.14 RPI1.39 | R7.2 46.51,24.5
  Top 0.6: J1.3 14.51,29.07 14.41,29.18 | J3.3 22.51,29.07 22.41,29.18 | J2.3 30.51,29.07 30.41,29.18 | C2.1 41.11,29.18 | C12.1 IC1.1 37.96,29.12 37.91,29.18
  Top 0.7: 16.01,1.3 21.01,1.3 24.91,1.3 33.81,1.3 41.41,1.3 45.21,1.3 50.61,1.3 51.56,2.25 RPI1.6 | RPI1.30 21.08,1.37 | RPI1.20 33.78,1.33 | RPI1.14 41.4,1.31 | 9.68,1.63 10.01,1.3 12.84,1.3 12.86,1.28 14.06,1.28 14.08,1.3 16.01,1.3 | 16.01,1.3 RPI1.34
  Top 1.6: U$7.GND 61.71,20.1
  Top 2: 61.71,20.1 61.71,21.6 58.81,24.5 46.51,24.5 45.01,24.5 44.96,24.55 44.56,24.15 | U$8.GND_BATT 19.45,16.46 U$5.GND U$3.GND U$4.GND U$1.GND U$6.GND 36.87,16.46 40.33,19.93 40.65,20.24 44.56,24.15 | 44.56,24.15 43.21,25.5 43.21,27.8 41.83,29.18 41.11,29.18 37.91,29.18 J2.NC2 30.41,29.18 J2.NC1 J3.NC2 22.41,29.18 J3.NC1 J1.NC2 14.41,29.18 J1.NC1
  Bottom 0.2: IC2.25 37.31,15.7 IC2.9 37.31,17.9 | IC2.22 37.31,15.3 IC2.25 | IC2.25 38.11,14.9 IC2.20 | IC2.11 38.11,16.1 IC2.25 | IC2.18 38.51,14.5 IC2.25
  Bottom 0.3: RPI1.14 | RPI1.S14 RPI1.14 | RPI1.25 RPI1.S25 26.13,6.5 26.13,7.75 v25.38,8.5 | RPI1.25 | RPI1.S30 21.08,2.67 21.11,2.7 RPI1.30 | RPI1.S39 RPI1.39 | RPI1.39 | RPI1.S34 RPI1.34 | RPI1.34 | RPI1.S20 RPI1.20 | RPI1.20 | 37.31,17.9 37.26,17.95 C1.1 36.86,19.3 v36.86,20.27 | v36.13,8.88 C10.1 | C11.2 55.76,15.12 55.76,14.12 C13.1 55.63,14.12 55.08,14.12 55.08,14.1 54.73,13.75 IC4.12 52.51,13.75 52.51,8.62 | 51.26,23.12 52.13,23.12 C3.1 52.08,23.59 52.68,24.2 58.13,24.2 61.38,20.95 61.38,20.12 U$7.GND | 51.26,23.12 50.88,23.12 R6.1 | IC4.63 51.26,23.12 | IC4.47 41.26,18.75 41.26,18.77 41.13,18.9 v41.13,19.75 | IC4.31 44.76,8.78 46.38,7.15 46.38,6.5 RPI1.S9 46.51,6.38 46.51,5.38 RPI1.9 | IC4.18 51.26,8.68 51.41,8.53 52.51,8.53 52.51,8.62 | 52.51,8.62 52.63,8.62 52.81,8.5 | v53.51,10 53.51,9.1 53.61,9 | RPI1.S6 | RPI1.S6 51.56,2.84 | RPI1.S6 51.56,2.64 | RPI1.S6 51.86,1.85 51.86,2.95
  Bottom 0.5: U$7.GND 61.51,13.5 57.01,9 53.61,9 53.31,9 52.81,8.5 52.81,3.89 51.86,2.95 51.56,2.64 | 51.56,2.84 RPI1.6
  Bottom 0.6: U$8.GND_BATT 16.71,21.4 15.91,22.2 4.41,22.2 1.01,18.8 1.01,17.7 | 1.01,17.7 1.01,15.4 | 1.01,15.4 1.01,12.43 J7.NC2 | J7.3 1.01,15.4 | J7.NC1 1.01,17.7
IMU_SCL__SPI_SCLK  (via drill 0.3)
  Top 0.2: v39.13,8.55 39.81,7.88 45.26,7.88 v48.51,11.12
  Bottom 0.2: v39.13,8.55 39.03,8.65 39.03,10.85 36.88,13 36.88,14 IC2.23 | v48.51,11.12 47.51,12.12 47.51,18.5 48.63,19.62 48.63,20.25 48.76,20.38 IC4.58
IMU_SDA__SPI_SDI  (via drill 0.3)
  Top 0.2: v36.01,11.75 44.26,11.75 v44.88,12.38 | v47.13,19 48.01,19.88 v49.26,19.88
  Bottom 0.2: v36.01,11.75 36.01,13.38 36.51,13.88 IC2.24 | v44.88,12.38 47.13,14.62 v47.13,19 | IC4.59 v49.26,19.88
LED_A  (via drill 0.3)
  Top 0.2: v54.76,11 54.76,9.8 52.46,7.5 LED1.2
  Bottom 0.2: v54.76,11 54.76,12.12 54.63,12.25 IC4.15
LED_K
  Top 0.2: LED1.1 R5.1
N$1  (via drill 0.3)
  Top 0.2: U$6.SHDN 34.49,11.38 35.48,12.38 v40.51,12.38 | v40.76,15.8 41.83,16.88 v45.01,16.88 | v46.93,22.9 45.13,21.1 v45.13,19.5 | v45.43,27.57 45.43,27.68 45.83,28.07 46.43,28.07 R7.1
  Top 0.4: R7.1 47.21,28.7 51.16,28.7 S1.1
  Bottom 0.2: v40.51,12.38 40.76,12.62 v40.76,15.8 | v45.01,16.88 45.13,17 v45.13,19.5 | v46.93,22.9 46.63,23.2 46.63,26.38 v45.43,27.57
N$2
  Bottom 0.2: IC2.10 37.71,17.6 38.56,18.45 C1.2
N$6
  Bottom 0.2: IC4.60 49.76,23 R6.2
N$7
  Bottom 0.2: IC4.7 54.83,16.25 54.96,16.38 55.76,16.38 C11.1
N$8  (via drill 0.3)
  Top 0.2: v47.63,11.12 46.63,10.12 44.88,10.12 43.86,9.1 41.91,9.1 41.86,9.15 38.59,9.15 v38.11,8.68
  Bottom 0.2: v38.11,8.68 38.11,8.78 38.26,8.93 C10.2 | v47.63,11.12 46.88,11.88 45.26,11.88 IC4.30
RPIZW_UART_CTS  (via drill 0.3)
  Top 0.2: v40.51,11.12 40.38,11 v37.01,11
  Bottom 0.2: IC4.35 41.13,12.75 41.13,11.75 v40.51,11.12 | v37.01,11 36.71,11 35.08,9.38 35.08,4.58 34.51,4 14.41,4 13.46,3.05 RPI1.S36
  Bottom 0.3: RPI1.S36 RPI1.36 | RPI1.36
RPIZW_UART_RTS
  Bottom 0.2: IC4.34 IC4.33 42.27,9.56 43.38,8.45 43.38,7.75 43.88,7.25 43.88,6.5 RPI1.S11 44.01,6.38 44.01,5.38 RPI1.11
RPIZW_UART_RXD  (via drill 0.3)
  Top 0.2: v46.26,11.12 46.13,11 v41.38,11
  Bottom 0.2: 41.28,9.62 41.38,9.62 v41.38,11 | 41.28,9.62 40.76,9.62 R15.1 | v46.26,11.12 IC4.28 | RPI1.10 46.38,2.75 RPI1.S10 RPI1.10 | RPI1.10 45.21,4 43.16,4 42.71,4.45 42.71,8.2 41.28,9.62
RPIZW_UART_TXD
  Bottom 0.2: IC4.29 45.76,8.78 45.98,8.55 47.76,8.55 | IC4.25 47.76,8.55 | 47.76,8.55 47.76,4.12 49.01,2.88 RPI1.8
  Bottom 0.3: 49.02,2.76 RPI1.8 | RPI1.S8 49.02,2.76 | 49.02,2.76
SENSOR_HEAD_PADDING  (via drill 0.3)
  Top 0.2: v48.76,8.5 48.38,8.5 46.38,6.5 18.91,6.5 12.06,13.35 v12.06,14.47
  Bottom 0.2: v12.06,14.47 5.08,14.47 J7.2 | v48.76,8.5 IC4.23
SENSOR_NOSE_BUMPER  (via drill 0.3)
  Top 0.2: v13.38,13.4 13.38,13.12 19.63,6.88 46.06,6.88 48.41,9.22 49.21,9.22 49.93,8.5 v50.03,8.5
  Bottom 0.2: J7.1 v13.38,13.4 | v50.03,8.5 49.76,8.78 IC4.21
SERVO_HEAD_SPINE_RX_MCLOCK  (via drill 0.3)
  Top 0.2: v19.03,25.5 J1.1 | v32.51,27.15 32.56,27.1 34.28,27.1 v35.63,25.75 | v40.63,17.88 40.88,18.12 v48.13,18.12
  Bottom 0.2: v19.03,25.5 30.91,25.5 30.91,25.55 v32.51,27.15 | v35.63,25.75 39.51,25.75 39.51,23.62 38.26,22.38 38.26,21.4 39.96,19.7 39.96,18.55 v40.63,17.88 | v48.13,18.12 48.76,17.5 48.76,14.5 51.76,11.5 IC4.17
SERVO_HEAD_SPINE_TX  (via drill 0.3)
  Top 0.2: v34.63,20.88 36.63,22.88 R14.2 | v20.28,22.68 18.86,24.1 16.13,24.1 15.51,24.73 J1.2 | v53.26,11 50.38,11 49.63,11.75 47.38,11.75 46.88,11.25 46.88,10.88 46.51,10.5 42.56,10.5 42.43,10.38 v34.26,10.38
  Bottom 0.2: v34.63,20.88 34.63,10.88 34.2,10.44 | 34.2,10.44 32.88,9.12 20.78,9.12 19.21,10.7 19.21,21.6 v20.28,22.68 | v53.26,11 53.26,11.38 53.63,11.75 IC4.16 | 34.2,10.44 v34.26,10.38
SERVO_LEG_LEFT_FRONT_RX_MCLOCK  (via drill 0.3)
  Top 0.2: J3.1 26.21,25.5 27.08,26.38 v27.13,26.38 | v48.41,27.9 48.41,27.25 v47.36,26.2
  Bottom 0.2: v27.13,26.38 30.83,30.07 46.23,30.07 v48.41,27.9 | IC4.54 IC4.55 47.26,22.15 47.71,22.6 47.71,25.85 v47.36,26.2
SERVO_LEG_LEFT_FRONT_TX  (via drill 0.3)
  Top 0.2: v38.88,22.12 38.48,22.12 38.11,22.5 R10.2 | J3.2 23.51,27 v29.63,27 | v44.38,29.38 44.81,28.95 44.81,26.95 v45.13,26.62
  Bottom 0.2: v38.88,22.12 40.13,23.38 40.13,24.82 41.43,26.12 45.13,26.12 | 45.13,26.12 46.26,26.12 IC4.53 | v29.63,27 29.63,27.05 31.96,29.38 v44.38,29.38 | 45.13,26.12 v45.13,26.62
SERVO_LEG_RIGHT_FRONT_RX_MCLOCK  (via drill 0.3)
  Top 0.2: J2.1 32.53,25.48 32.98,25.48 v33.38,25.88 | v48.13,17.25 47.88,17.5 v46.51,17.5 | v49.38,11.12 45.51,7.25 23.26,7.25 20.06,10.45 v20.06,11.35
  Bottom 0.2: v33.38,25.88 33.38,25.75 30.03,22.4 21.68,22.4 20.38,21.1 20.38,11.68 v20.06,11.35 | v49.38,11.12 48.13,12.38 v48.13,17.25 | v46.51,17.5 45.76,18.25 IC4.52 45.76,22.25 44.88,22.25 44.76,22.12 IC4.50
SERVO_LEG_RIGHT_FRONT_TX  (via drill 0.3)
  Top 0.2: v41.13,23.23 41.06,23.23 40.46,22.62 | 40.46,22.62 39.78,22.62 R12.2 | J2.2 31.51,24.52 32.91,23.12 v33.31,23.12 | v37.01,22 37.71,21.3 39.13,21.3 40.46,22.62
  Bottom 0.2: v41.13,23.23 41.08,23.27 41.08,24.18 42.28,25.38 43.76,25.38 43.76,20.38 44.01,20.12 45.26,20.12 IC4.51 | v37.01,22 34.43,22 v33.31,23.12
SUPPLY_HALF_VOLTAGE
  Top 0.3: U$7.S1/S2 59.01,21 57.51,22.5 53.11,22.5 50.61,20 R1.2
SWCLK
  Bottom 0.2: PAD25.1 44.26,23.75 IC4.49
SWDIO  (via drill 0.3)
  Top 0.2: v45.51,22.88 45.51,22.57 v43.13,20.2
  Bottom 0.2: PAD26.1 43.13,24.38 v43.13,20.2 | v45.51,22.88 45.86,23.23 45.86,25.35 45.46,25.75 41.96,25.75 40.51,24.3 40.51,18.88 41.13,18.25 IC4.46
V5_RPIZW
  Bottom 0.5: RPI1.4 54.3,2.53 56.07,2.53 RPI1.S2 RPI1.2 | RPI1.S4 RPI1.4 | RPI1.4 | RPI1.2
  Bottom 0.6: U$1.VOUT 30.01,21.3 37.21,28.5 46.51,28.5 49.51,25.5 58.11,25.5 60.11,23.5 61.51,23.5 63.51,21.5 63.51,11 58.51,6 58.51,3 58.01,2.5 56.87,2.5 RPI1.2
V6_HEAD_AND_SPINE
  Top 0.6: U$5.VOUT 19.61,21.9 18.51,23 14.91,23 13.51,24.4 J1.4
V6_LEGS_LEFT
  Top 0.6: J3.4 21.51,24 22.41,23.1 23.31,23.1 25.01,21.4 U$3.VOUT
V6_LEGS_RIGHT
  Top 0.6: J2.4 29.51,24.5 27.51,22.5 U$4.VOUT
V+  (via drill 0.35)
  Top 0.3: R2.2 56.21,19.6
  Top 0.4: v63.51,24.5 63.51,17.5 63.01,17 56.41,17 56.21,17.2
  Top 1.6: U$7.VCC 56.21,19.6
  Top 2: 56.21,19.6 56.21,17.2 52.93,13.92 U$6.VIN U$1.VIN U$4.VIN U$3.VIN U$5.VIN 16.23,13.92 13.51,16.64 U$8.VCC_BATT
  Bottom 0.4: S1.3 60.44,24.5 v63.51,24.5
  Bottom 0.5: S1.2 S1.3